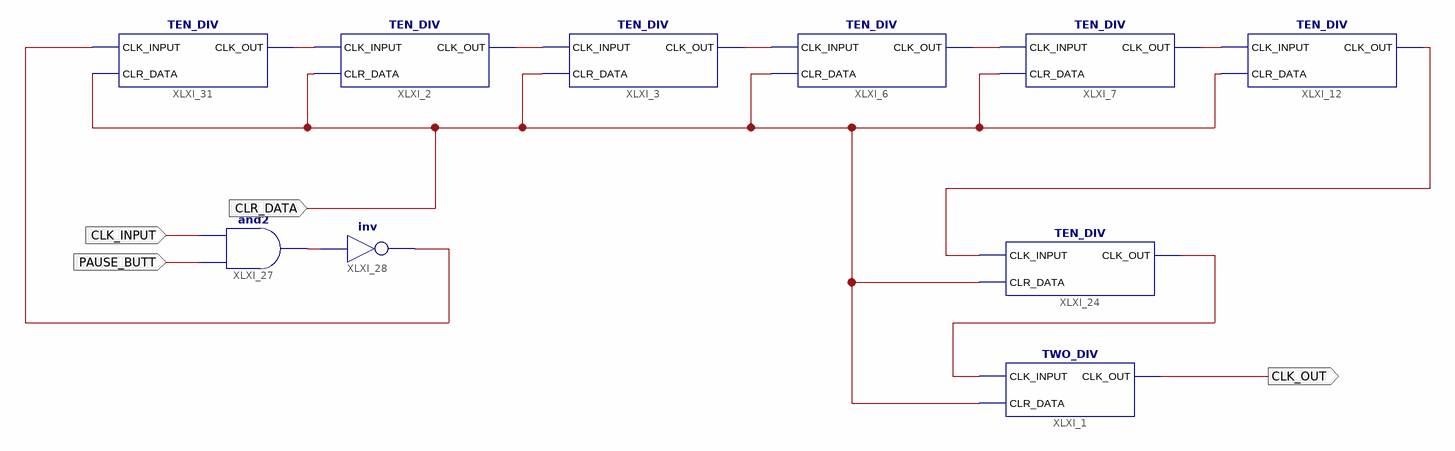
[diagram p0: schematic sheet 1]
// Xilinx ISE schematic DIVIDER_20Mhz_TO_1Hz.sch (spartan6) as structural Verilog: 10 symbols, 4 ports
module DIVIDER_20Mhz_TO_1Hz (
  input  CLR_DATA,
  input  CLK_INPUT,
  input  PAUSE_BUTT,
  output CLK_OUT
);

  wire XLXN_1, XLXN_2, XLXN_3, XLXN_4, XLXN_5, XLXN_6, XLXN_59, XLXN_61, XLXN_62;

  TEN_DIV XLXI_12 (.CLK_INPUT(XLXN_5), .CLK_OUT(XLXN_6), .CLR_DATA(CLR_DATA));
  TEN_DIV XLXI_2 (.CLK_INPUT(XLXN_1), .CLK_OUT(XLXN_2), .CLR_DATA(CLR_DATA));
  TEN_DIV XLXI_3 (.CLK_INPUT(XLXN_2), .CLK_OUT(XLXN_3), .CLR_DATA(CLR_DATA));
  TEN_DIV XLXI_6 (.CLK_INPUT(XLXN_3), .CLK_OUT(XLXN_4), .CLR_DATA(CLR_DATA));
  TEN_DIV XLXI_7 (.CLK_INPUT(XLXN_4), .CLK_OUT(XLXN_5), .CLR_DATA(CLR_DATA));
  TEN_DIV XLXI_24 (.CLK_INPUT(XLXN_6), .CLK_OUT(XLXN_61), .CLR_DATA(CLR_DATA));
  and XLXI_27 (XLXN_62, PAUSE_BUTT, CLK_INPUT);
  not XLXI_28 (XLXN_59, XLXN_62);
  TWO_DIV XLXI_1 (.CLK_INPUT(XLXN_61), .CLR_DATA(CLR_DATA), .CLK_OUT(CLK_OUT));
  TEN_DIV XLXI_31 (.CLK_INPUT(XLXN_59), .CLK_OUT(XLXN_1), .CLR_DATA(CLR_DATA));
endmodule
